# Altium schematic sheet Power.SchDoc
size A4
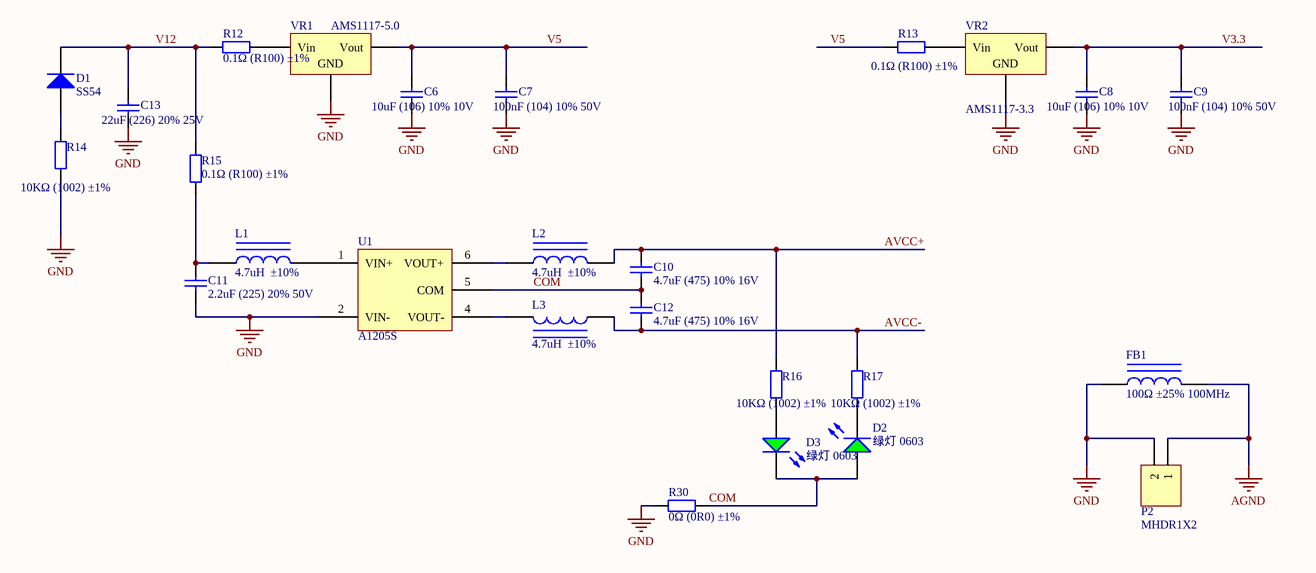
[diagram p0: Power.SchDoc]

## Parts
C6  10uF (106) 10% 10V  [0603_C]
C7  100nF (104) 10% 50V  [0603_C]
C8  10uF (106) 10% 10V  [0603_C]
C9  100nF (104) 10% 50V  [0603_C]
C10  4.7uF (475) 10% 16V  [0603_C]
C11  2.2uF (225) 20% 50V  [0805_C]
C12  4.7uF (475) 10% 16V  [0603_C]
C13  22uF (226) 20% 25V  [0805_C]
D1  SS54  [SMA(DO-214AC)_S1]
D2  绿灯 0603  [0603_LED_S1]
D3  绿灯 0603  [0603_LED_S1]
FB1  100Ω ±25% 100MHz  [0805_L]
L1  4.7uH  ±10%  [1206_L]
L2  4.7uH  ±10%  [1206_L]
L3  4.7uH  ±10%  [1206_L]
P2  MHDR1X2  [MHDR1X2]
R12  0.1Ω (R100) ±1%  [1206_R]
R13  0.1Ω (R100) ±1%  [1206_R]
R14  10KΩ (1002) ±1%  [0805_R]
R15  0.1Ω (R100) ±1%  [1206_R]
R16  10KΩ (1002) ±1%  [0603_R]
R17  10KΩ (1002) ±1%  [0603_R]
R30  0Ω (0R0) ±1%  [1206_R]
U1  A1205S  [A1205S]
VR1  AMS1117-5.0  [SOT-223]
VR2  AMS1117-3.3  [SOT-223]

## Nets
AGND: FB1.2 P2.1
GND: C6.1 C7.1 C8.1 C9.1 C11.1 C13.1 FB1.1 P2.2 R14.1 R30.1 U1.2(VIN-) VR1.1(GND) VR2.1(GND)
AVCC+: C10.2 L2.2 R16.2
AVCC-: C12.1 L3.2 R17.2
COM: C10.1 C12.2 D2.A D3.K R30.2 U1.5(COM)
V3.3: C8.2 C9.2 VR2.2(Vout)
V5: C6.2 C7.2 R13.1 VR1.2(Vout)
V12: C13.2 D1.2(K) R12.1 R15.2
NetC11_2: C11.2 L1.1 R15.1
NetD1_1: D1.1(A) R14.2
NetD2_K: D2.K R17.1
NetD3_A: D3.A R16.1
NetL1_2: L1.2 U1.1(VIN+)
NetL2_1: L2.1 U1.6(VOUT+)
NetL3_1: L3.1 U1.4(VOUT-)
NetR12_2: R12.2 VR1.3(Vin)
NetR13_2: R13.2 VR2.3(Vin)

## Library data of the parts
C6 C8 = 0603 10uF (106) 10% 10V: 贴片电容; ComponentLink1Description: 供应商链接; ComponentLink1URL: http://www.szlcsc.com/product/details_20411.html; Package: 0603; Supplier: LC; SuppliersPartNumber: C19702
C7 C9 = 0603 100nF (104) 10% 50V: 贴片电容; ComponentLink1Description: 供应商链接; ComponentLink1URL: http://www.szlcsc.com/product/details_15331.html; Package: 0603; Supplier: LC; SuppliersPartNumber: C14663
C10 C12 = 0603 4.7uF (475) 10% 16V: 贴片电容; ComponentLink1Description: 供应商链接; ComponentLink1URL: http://www.szlcsc.com/product/details_20375.html; Package: 0603; Supplier: LC; SuppliersPartNumber: C19666
C11 = 0805 2.2uF (225) 20% 50V: 贴片电容; ComponentLink1Description: 供应商链接; ComponentLink1URL: http://www.szlcsc.com/product/details_50225.html; Package: 0805; Supplier: LC; SuppliersPartNumber: C49217
C13 = 0805 22uF (226) 20% 25V: 贴片电容; ComponentLink1Description: 供应商链接; ComponentLink1URL: http://www.szlcsc.com/product/details_46786.html; Package: 0805; Supplier: LC; SuppliersPartNumber: C45783
D1 = SMA(DO-214AC) SS54: 二极管; ComponentLink1Description: 供应商链接; ComponentLink1URL: http://www.szlcsc.com/product/details_23178.html; Package: SMA(DO-214AC); Supplier: LC; SuppliersPartNumber: C22452
D2 D3 = 0603 绿灯: 发光二极管; ComponentLink1Description: 供应商链接; ComponentLink1URL: http://www.szlcsc.com/product/details_73152.html; Package: 0603; Supplier: LC; SuppliersPartNumber: C72043
FB1 = 0805 100Ω 25% 100MHz: 贴片磁珠; ComponentLink1Description: 供应商链接; ComponentLink1URL: http://www.szlcsc.com/product/details_1367.html; Package: 0805; Supplier: LC; SuppliersPartNumber: C1015
L1-L3 = 1206 4.7uH  10%: 贴片电感; ComponentLink1Description: 供应商链接; ComponentLink1URL: http://www.szlcsc.com/product/details_1401.html; Package: 1206; Supplier: LC; SuppliersPartNumber: C1049
P2 = MHDR1X2: Header, 2-Pin; LatestRevisionDate: 17-Jul-2002; LatestRevisionNote: Re-released for DXP Platform.; Publisher: Altium Limited
R12 R13 R15 = 1206 0.1Ω (R100) 1%: 贴片电阻; ComponentLink1Description: 供应商链接; ComponentLink1URL: http://www.szlcsc.com/product/details_26077.html; Package: 1206; Supplier: LC; SuppliersPartNumber: C25334
R14 = 0805 10KΩ (1002) 1%: 贴片电阻; ComponentLink1Description: 供应商链接; ComponentLink1URL: http://www.szlcsc.com/product/details_18102.html; Package: 0805; Supplier: LC; SuppliersPartNumber: C17414
R16 R17 = 0603 10KΩ (1002) 1%: 贴片电阻; ComponentLink1Description: 供应商链接; ComponentLink1URL: http://www.szlcsc.com/product/details_26547.html; Package: 0603; Supplier: LC; SuppliersPartNumber: C25804
R30 = 1206 0Ω (0R0) 1%: 贴片电阻; ComponentLink1Description: 供应商链接; ComponentLink1URL: http://www.szlcsc.com/product/details_18576.html; Package: 1206; Supplier: LC; SuppliersPartNumber: C17888
VR1 = SOT-223 AMS1117-5.0: 低压差线性稳压(LDO); ComponentLink1Description: 供应商链接; ComponentLink1URL: http://www.szlcsc.com/product/details_6653.html; Package: SOT-223; Supplier: LC; SuppliersPartNumber: C6187
VR2 = SOT-223 AMS1117-3.3: 低压差线性稳压(LDO); ComponentLink1Description: 供应商链接; ComponentLink1URL: http://www.szlcsc.com/product/details_6652.html; Package: SOT-223; Supplier: LC; SuppliersPartNumber: C6186